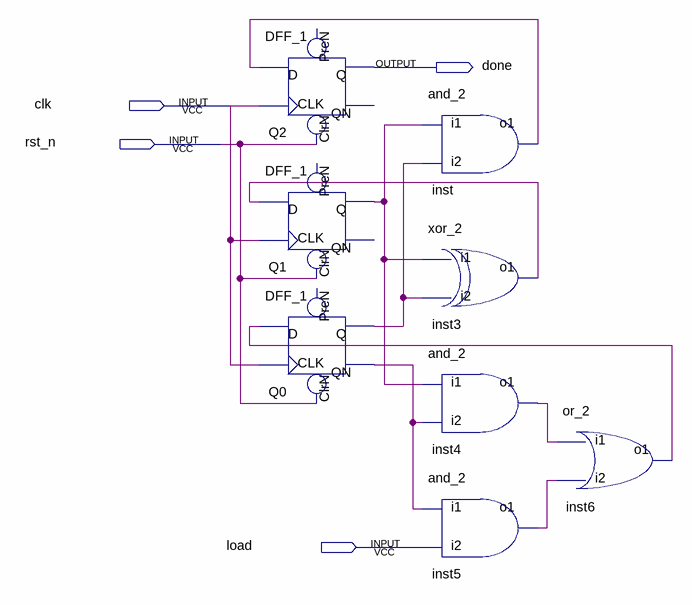
[diagram p0: schematic sheet]
// Quartus schematic Controller.bdf as structural Verilog: 8 symbols, 4 pins
module Controller (
  input  clk,
  input  rst_n,
  input  load,
  output done
);

  wire inst3_o1, inst4_o1, inst5_o1, inst6_o1, inst_o1, Q0_q, Q0_qn, Q1_q;

  DFF_1 Q2 (.CLK(clk), .D(inst_o1), .ClrN(rst_n), .Q(done));  // open: PreN, QN
  DFF_1 Q1 (.CLK(clk), .D(inst3_o1), .ClrN(rst_n), .Q(Q1_q));  // open: PreN, QN
  DFF_1 Q0 (.CLK(clk), .D(inst6_o1), .ClrN(rst_n), .QN(Q0_qn), .Q(Q0_q));  // open: PreN
  and_2 inst (.i1(Q1_q), .i2(Q0_q), .o1(inst_o1));
  xor_2 inst3 (.i1(Q1_q), .i2(Q0_q), .o1(inst3_o1));
  and_2 inst4 (.i1(Q1_q), .i2(Q0_qn), .o1(inst4_o1));
  and_2 inst5 (.i1(Q0_qn), .i2(load), .o1(inst5_o1));
  or_2 inst6 (.i1(inst4_o1), .i2(inst5_o1), .o1(inst6_o1));
endmodule
